# Altium schematic sheet [03]SDCard.SchDoc
size A4
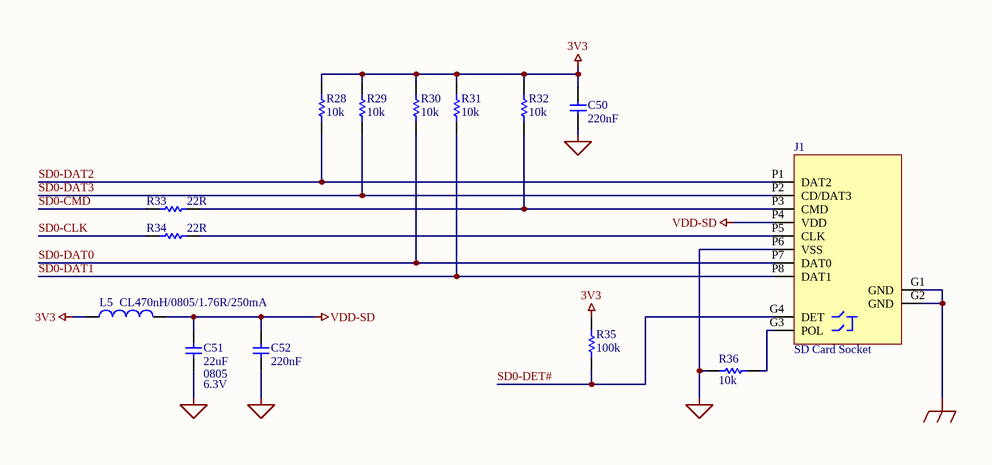
[diagram p0: [03]SDCard.SchDoc]

## Parts
C50  value 220nF  [C0402]  (hidden comment: SMD Capacitor Chip)
C51  value 22uF  Voltage: 6.3V  Package / Case: 0805  [C0805]  (hidden comment: SMD Capacitor Chip)
C52  value 220nF  [C0402]  (hidden comment: SMD Capacitor Chip)
J1  SD Card Socket
L5  value CL470nH/0805/1.76R/250mA  (hidden comment: SMD Coil Chip)
R28  value 10k  (hidden comment: SMD Resistor Chip)
R29  value 10k  (hidden comment: SMD Resistor Chip)
R30  value 10k  (hidden comment: SMD Resistor Chip)
R31  value 10k  (hidden comment: SMD Resistor Chip)
R32  value 10k  (hidden comment: SMD Resistor Chip)
R33  value 22R  (hidden comment: SMD Resistor Chip)
R34  value 22R  (hidden comment: SMD Resistor Chip)
R35  value 100k  (hidden comment: SMD Resistor Chip)
R36  value 10k  (hidden comment: SMD Resistor Chip)

## Nets
3V3: C50.2 L5.1 R28.1 R29.1 R30.1 R31.1 R32.1 R35.1
SGND: C50.1 C51.2 C52.1 J1.G1(GND) J1.G2(GND) J1.P6(VSS) R36.1
VDD-SD: C51.1 C52.2 J1.P4(VDD) L5.2
SD0-CLK: R34.1
SD0-CMD: R33.1
SD0-DAT0: J1.P7(DAT0) R30.2
SD0-DAT1: J1.P8(DAT1) R31.2
SD0-DAT2: J1.P1(DAT2) R28.2
SD0-DAT3: J1.P2(CD/DAT3) R29.2
SD0-DET#: J1.G4(DET) R35.2
NetJ1_G3: J1.G3(POL) R36.2
NetJ1_P3: J1.P3(CMD) R32.2 R33.2
NetJ1_P5: J1.P5(CLK) R34.2

## Library data of the parts
C50 C52 = CAP: SMD Capacitor; Tolerance: 20%; Voltage: 50V; MPN: ?; Package / Case: 0402
C51 = CAP: SMD Capacitor; Tolerance: 20%; MPN: ?
J1 = SD/MMC: SMD SD Card Socket; MPN: 502570-0893; Manufacturer: Molex
L5 = COIL: SMD Coil; Current Rating: 1A; Inductance: 4.7uH; MPN: ?; Series Resistance: ?
R28-R36 = RES: SMD Resistor; Tolerance: 1%; Package / Case: 0402; MPN: ?